# Altium schematic sheet Sheet2.SchDoc
size A4
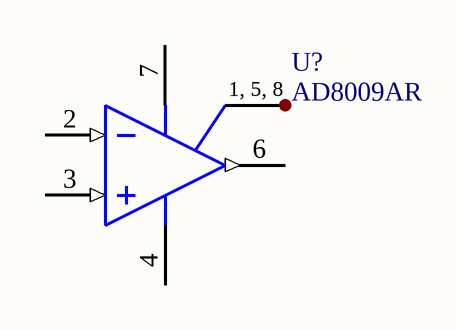
[diagram p0: Sheet2.SchDoc]

## Parts
U?  AD8009AR  [SO-8_N]

## Nets
NetU?_1: U?.1(NC) U?.5(NC) U?.8(NC)

Not connected (* = marked no-connect by the designer): U? 2(IN-) 3(IN+) 4(V-) 6(OUT) 7(V+)

## Notes on the sheet
- (in symbol AD8009AR) 1, 5, 8

## Library data of the parts
U? = AD8009AR: 1 GHz, 5,500 V/uS Low Distortion Amplifier; Note: Pin 1, 5 and 8 are not connected; Published: 8-Jun-2000; LatestRevisionDate: 13-Apr-2006; LatestRevisionNote: IPC-7351 Footprint Added.; DatasheetVersion: REV. 0 1996; PackageVersion: revA; PackageReference: SO-8; Publisher: Altium Limited; PackageDescription: 8-Pin Small Outline Integrated Circuit 1.27 mm Pitch; Code_JEDEC: MS-012-AA; Code_IPC: SOIC127P600-8; ComponentLink1Description: Manufacturer Link; ComponentLink1URL: http://www.analog.com/en/prod/0,,759_786_AD8009%2C00.html; ComponentLink2Description: Datasheet; ComponentLink2URL: http://www.analog.com/UploadedFiles/Data_Sheets/415408195AD8009_f.pdf